# Altium schematic sheet MEMS MICs.SchDoc
size A4
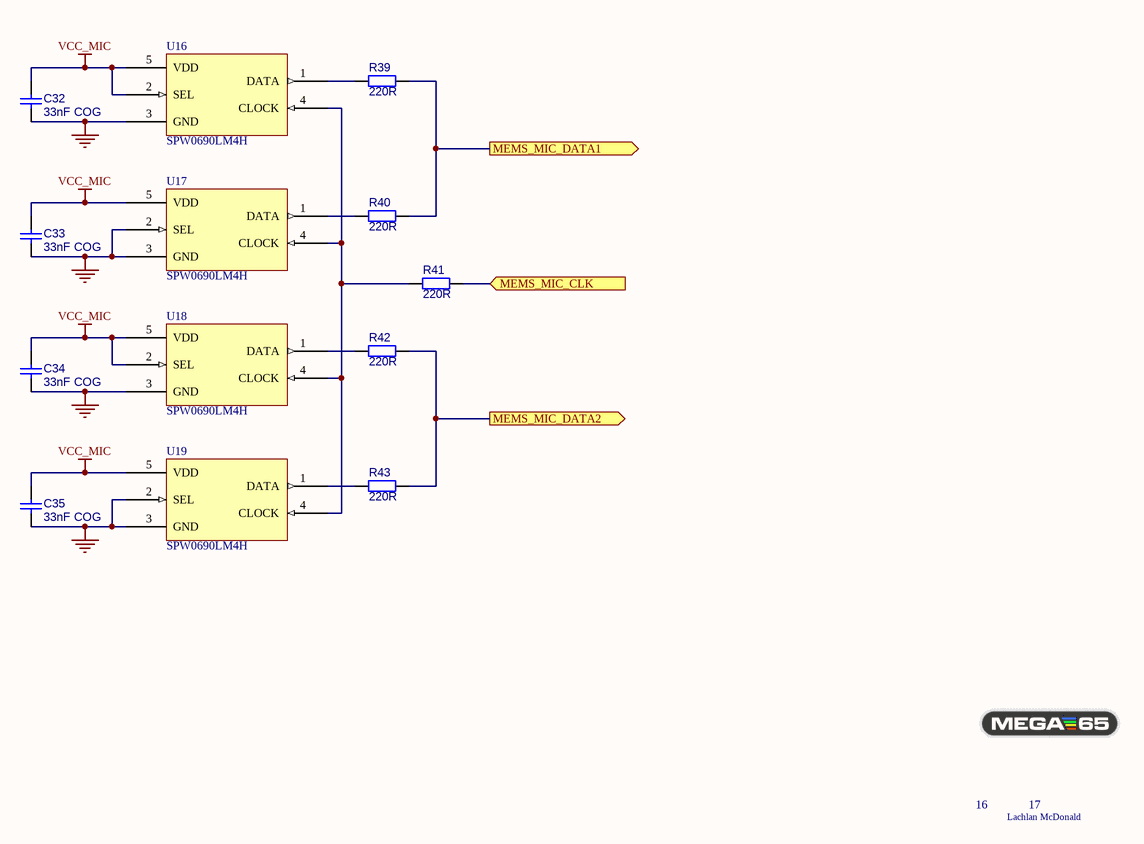
[diagram p0: MEMS MICs.SchDoc]

## Parts
C32  33nF COG  [0805 Reflow Cap]
C33  33nF COG  [0805 Reflow Cap]
C34  33nF COG  [0805 Reflow Cap]
C35  33nF COG  [0805 Reflow Cap]
R39  220R  [0603-RESISTOR HD]
R40  220R  [0603-RESISTOR HD]
R41  220R  [0603-RESISTOR HD]
R42  220R  [0603-RESISTOR HD]
R43  220R  [0603-RESISTOR HD]
U16  SPW0690LM4H  [MICROPHONE MEMS SPW0690LM4H-1]
U17  SPW0690LM4H  [MICROPHONE MEMS SPW0690LM4H-1]
U18  SPW0690LM4H  [MICROPHONE MEMS SPW0690LM4H-1]
U19  SPW0690LM4H  [MICROPHONE MEMS SPW0690LM4H-1]

## Ports
MEMS_MIC_CLK (in), MEMS_MIC_DATA1 (out), MEMS_MIC_DATA2 (out)

## Nets
GND: C32.2 C33.2 C34.2 C35.2 U16.3(GND) U17.2(SEL) U17.3(GND) U18.3(GND) U19.2(SEL) U19.3(GND)
VCC_MIC: C32.1 C33.1 C34.1 C35.1 U16.2(SEL) U16.5(VDD) U17.5(VDD) U18.2(SEL) U18.5(VDD) U19.5(VDD)
MEMS_MIC_CLK: R41.1 ; port MEMS_MIC_CLK
MEMS_MIC_DATA1: R39.1 R40.1 ; port MEMS_MIC_DATA1
MEMS_MIC_DATA2: R42.1 R43.1 ; port MEMS_MIC_DATA2
NetR39_2: R39.2 U16.1(DATA)
NetR40_2: R40.2 U17.1(DATA)
NetR41_2: R41.2 U16.4(CLOCK) U17.4(CLOCK) U18.4(CLOCK) U19.4(CLOCK)
NetR42_2: R42.2 U18.1(DATA)
NetR43_2: R43.2 U19.1(DATA)

## Notes on the sheet
- 16
- 17
- Lachlan McDonald
- Title
- Size:
- Date:
- A4
- Number:
- Revision:
- Sheet
- Drawn By:
- of
- File:

## Library data of the parts
C32-C35 = Cap: Capacitor; Manufacturer: TDK Corporation; Manufacturer Number: CGJ4J2C0G1H333J125AA; Value: 33nF COG; Digikey Number: 445-8162-1-ND
R39-R43 = Resistor: Value: 220R
U16-U19 = MEMs Microphone: Manufacturer: Knowles; Manufacturer Number: SPW0690LM4H-1; Digikey Number: 423-1423-1-ND